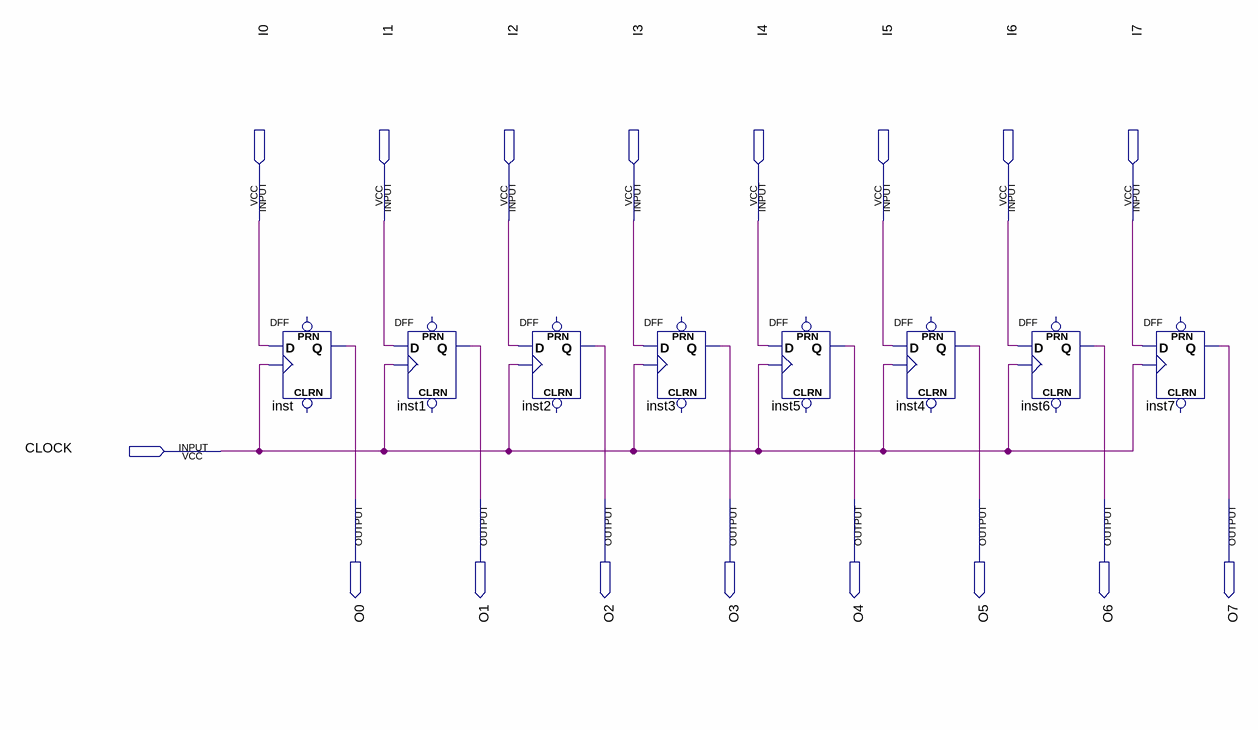
[diagram p0: schematic sheet]
// Quartus schematic reg_paral_paral.bdf as structural Verilog: 8 symbols, 17 pins
module reg_paral_paral (
  input  I0,
  input  I1,
  input  I2,
  input  I3,
  input  I4,
  input  I5,
  input  I6,
  input  I7,
  input  CLOCK,
  output O0,
  output O1,
  output O2,
  output O3,
  output O4,
  output O5,
  output O6,
  output O7
);

  DFF inst (.CLK(CLOCK), .D(I0), .Q(O0));  // open: CLRN, PRN
  DFF inst1 (.CLK(CLOCK), .D(I1), .Q(O1));  // open: CLRN, PRN
  DFF inst2 (.CLK(CLOCK), .D(I2), .Q(O2));  // open: CLRN, PRN
  DFF inst3 (.CLK(CLOCK), .D(I3), .Q(O3));  // open: CLRN, PRN
  DFF inst5 (.CLK(CLOCK), .D(I4), .Q(O4));  // open: CLRN, PRN
  DFF inst4 (.CLK(CLOCK), .D(I5), .Q(O5));  // open: CLRN, PRN
  DFF inst6 (.CLK(CLOCK), .D(I6), .Q(O6));  // open: CLRN, PRN
  DFF inst7 (.CLK(CLOCK), .D(I7), .Q(O7));  // open: CLRN, PRN
endmodule
